# Altium schematic sheet Ethernet.SchDoc
size A3; SheetNumber: 6; SheetTotal: 8; DocumentSheetName: Ethernet
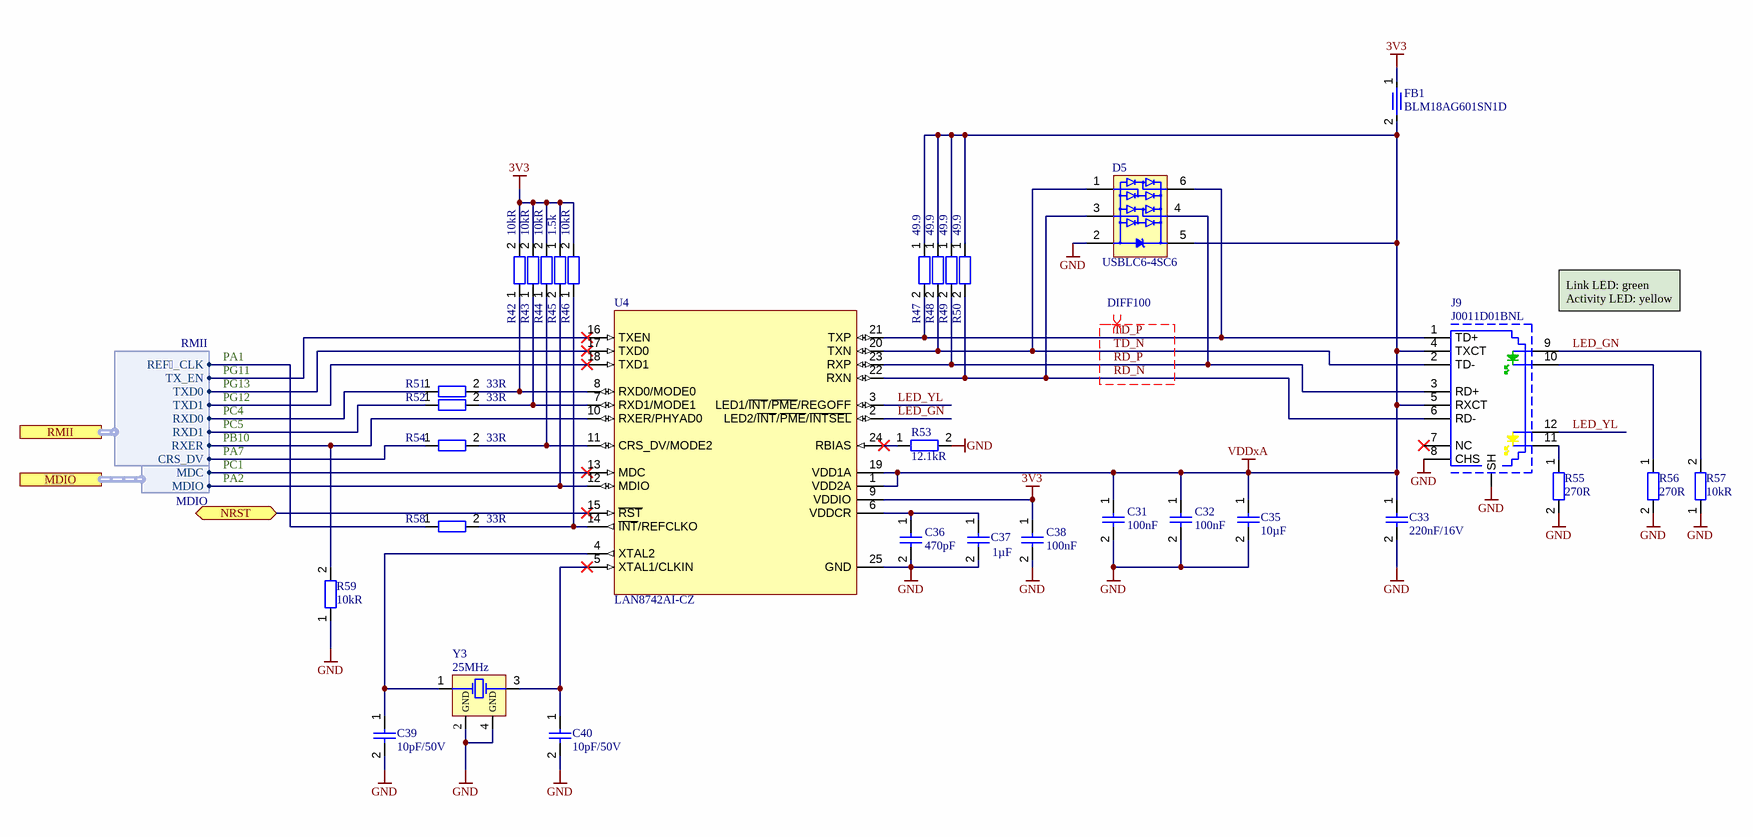
[diagram p0: Ethernet.SchDoc]

## Parts
C31  value 100nF  [CAPC1005X50N]  (hidden comment: 100nF/16V)
C32  value 100nF  [CAPC1005X50N]  (hidden comment: 100nF/16V)
C33  220nF/16V  [CAPC1005X50N]
C35  value 10µF  [CAPC1608X80N]  (hidden comment: 10uF/10V)
C36  value 470pF  [CAPC1005X50N]  (hidden comment: 470pF/50V)
C37  value 1µF  [CAPC1608X80N]  (hidden comment: 1uF/16V)
C38  value 100nF  [CAPC1608X80N]  (hidden comment: 100nF/50V)
C39  10pF/50V  [CAPC1005X50N]
C40  10pF/50V  [CAPC1005X50N]
D5  USBLC6-4SC6  [SOT95P280X120-6L]
FB1  BLM18AG601SN1D  [INDC1608X08L]
J9  J0011D01BNL  [PULSE_J0011D01BNL]
R42  10kR  [RESC1005X35N]
R43  10kR  [RESC1005X35N]
R44  10kR  [RESC1005X35N]
R45  value 1.5k  [RESC1005X35N]  (hidden comment: 1.5kR)
R46  10kR  [RESC1005X35N]
R47  value 49.9  [RESC1005X35N]  (hidden comment: 49.9R/0.1%)
R48  value 49.9  [RESC1005X35N]  (hidden comment: 49.9R/0.1%)
R49  value 49.9  [RESC1005X35N]  (hidden comment: 49.9R/0.1%)
R50  value 49.9  [RESC1005X35N]  (hidden comment: 49.9R/0.1%)
R51  33R  [RESC1005X35N]
R52  33R  [RESC1005X35N]
R53  12.1kR  [RESC1005X35N]
R54  33R  [RESC1005X35N]
R55  270R  [RESC1005X35N]
R56  270R  [RESC1005X35N]
R57  10kR  [RESC1005X35N]
R58  33R  [RESC1005X35N]
R59  10kR  [RESC1005X35N]
U4  LAN8742AI-CZ  [QFN50P400X400X90-25T260X260L]
Y3  Frequency: 25MHz  [OSCCC160X120X45-4]  (hidden comment: ABM12W-25.0000MHZ-8-B1U-T3)

## Ports
MDIO (harness MDIO), NRST (bidir), RMII (harness RMII)

## Harnesses
RMII: REF_CLK, TX_EN, TXD0, TXD1, RXD0, CRS_DV, RXD1, RXER
MDIO: MDC, MDIO

## Nets
3V3: C38.1 FB1.1 R42.2 R43.2 R44.2 R45.1 R46.2 U4.9(VDDIO)
GND: C31.2 C32.2 C33.2 C35.2 C36.2 C37.2 C38.2 C39.2 C40.2 D5.2(GND) J9.8(CHS) J9.SH R53.2 R55.2 R56.2 R57.1 R59.1 U4.25(GND) Y3.2(GND) Y3.4(GND)
VDDxA: C31.1 C32.1 C33.1 C35.1 D5.5(VBUS) FB1.2 J9.4(TXCT) J9.5(RXCT) R47.1 R48.1 R49.1 R50.1 U4.1(VDD2A) U4.19(VDD1A)
LED_GN: J9.9 R57.2 U4.2(LED2/~{INT}/~{PME}/~{INTSEL})
LED_YL: J9.12 U4.3(LED1/~{INT}/~{PME}/REGOFF)
NRST: U4.15(~{RST}) ; port NRST
RD_N: D5.3(I/O2) J9.6(RD-) R50.2 U4.22(RXN)
RD_P: D5.4(I/O3) J9.3(RD+) R49.2 U4.23(RXP)
TD_N: D5.1(I/O1) J9.2(TD-) R48.2 U4.20(TXN)
TD_P: D5.6(I/O4) J9.1(TD+) R47.2 U4.21(TXP)
NetC36_1: C36.1 C37.1 U4.6(VDDCR)
NetC39_1: C39.1 U4.4(XTAL2) Y3.1(X1)
NetC40_1: C40.1 U4.5(XTAL1/CLKIN) Y3.3(X2)
NetJ9_10: J9.10 R56.1
NetJ9_11: J9.11 R55.1
NetR42_1: R42.1 R51.2 U4.8(RXD0/MODE0)
NetR43_1: R43.1 R52.2 U4.7(RXD1/MODE1)
NetR44_1: R44.1 R54.2 U4.11(CRS_DV/MODE2)
NetR45_2: R45.2 U4.12(MDIO) ; port MDIO.MDIO
NetR46_1: R46.1 R58.2 U4.14(~{INT}/REFCLKO)
NetR51_1: R51.1 ; port RMII.RXD0
NetR52_1: R52.1 ; port RMII.RXD1
NetR53_1: R53.1 U4.24(RBIAS)
NetR54_1: R54.1 ; port RMII.CRS_DV
NetR58_1: R58.1 ; port RMII.REF_CLK
NetR59_2: R59.2 U4.10(RXER/PHYAD0) ; port RMII.RXER
NetU4_13: U4.13(MDC) ; port MDIO.MDC
NetU4_16: U4.16(TXEN) ; port RMII.TX_EN
NetU4_17: U4.17(TXD0) ; port RMII.TXD0
NetU4_18: U4.18(TXD1) ; port RMII.TXD1

Not connected (* = marked no-connect by the designer): J9 7(NC)*

## Layout directives
differential pair; differential pair class DIFF100: RD_N, RD_P, TD_N, TD_P

## Notes on the sheet
- (near J9) Link LED: green
  Activity LED: yellow
- PG13
- PG11
- PC4
- PA1
- PG12
- PC5
- PB10
- PA7
- PC1
- PA2
- Sheet Name
- Project Name
- Variant:
- Doc Number
- File:
- Repo:
- Revision:
- Date:
- Author:
- VC Rev:
- Sheet

## Library data of the parts
C31 C32 = CMP-001-00001-22: Cap MLCC, 100nF, 16V, X7R, 5%,  0402; Dielectricum: X7R; Type: MLCC; Case Code (Metric): 1005; Voltage Rating: 16V; Case/Package: 0402; Mounting Technology: SMD; Tolerance: 5%
C33 = CMP-00178-7: Cap MLCC, 220nF, 16V, X7R, 10%, 0402; Value: 220nF; Case/Package: 0402; Tolerance: 10%; Type: MLCC; Dielectricum: X7R; Case Code (Metric): 1005; Mounting Technology: SMD; Voltage Rating: 16V
C35 = CMP-001-00075-19: Cap MLCC, 10uF, 10V, X5R, 10%, 0603; Mounting Technology: SMD; Type: MLCC; Case Code (Metric): 1608; Voltage Rating: 10V; Tolerance: 10%; Dielectricum: X5R; Case/Package: 0603
C36 = CMP-00111-11: Cap MLCC, 470pF, 50V, COG, 1%, 0402; Dielectricum: C0G; Type: MLCC; Case/Package: 0402; Mounting Technology: SMD; Voltage Rating: 50V; Tolerance: 1%; Case Code (Metric): 1005
C37 = CMP-001-00004-21: Cap MLCC, 1uF, 16V, X7R, 10%, 0603; Type: MLCC; Mounting Technology: SMD; Case Code (Metric): 1608; Tolerance: 10%; Dielectricum: X7R; Case/Package: 0603; Voltage Rating: 16V
C38 = CMP-001-00017-21: Cap MLCC, 100nF, 50V, X7R, 10%, 0603; Voltage Rating: 50V; Dielectricum: X7R; Tolerance: 10%; Type: MLCC; Mounting Technology: SMD; Case Code (Metric): 1608; Case/Package: 0603
C39 C40 = CMP-001-00011-22: Cap MLCC, 10pF, 50V, C0G, 2.5%, 0402; Case/Package: 0402; Mounting Technology: SMD; Dielectricum: C0G; Voltage Rating: 50V; Case Code (Metric): 1005; Type: MLCC; Value: 10pF; Tolerance: 2.5%
D5 = CMP-00732-4: TVS Diode, unidirectional, 4 Signal + 2 Supply, 6Vbr, 5A, SOT23-6L, 4 data-line very low capacitance ESD protection; Rated Voltage: 6V; Peak Current: 5A; Direction: unidirectional; Mounting Technology: SMD; Size: L2.9B1.6H1.2; Case/Package: SOT-23-6L; Connection: 4 Signal + 2 Supply
FB1 = CMP-006-00088-4: Ferrite Bead, 0.38R @ DC, 600R @ 100MHz, 25%, 0603; Current: 500mA; Impedance DC: 0.38; Case/Package: 0603; Mounting Technology: SMD; Impedance: 600R @ 100MHz; Tolerance: 25%; Case Code (Metric): 1608
J9 = CMP-00777-4: RJ45, 12 Pin, Female, Horizontal, THT, L22B16H14, with Magnetics, Shielded, 2 LED gn/ye; Manufacturer: Pulse; Connection: Pluggable; Pin Mapping: 2x4; Mounting Technology: THT; Angle: Horizontal; Size: L22B16H14; Gender: Female; Type: RJ45; Pins: 12
R42-R44 R46 R57 R59 = CMP-009-00298-12: Res, 10kR, 1%, 0.063W, 0402; Value: 10k; Power: 63mW; Voltage Rating: 50V; Tolerance: 1%; Type: Fixed; Case Code (Metric): 1005; Case/Package: 0402; Mounting Technology: SMD
R45 = CMP-009-00284-14: Res, 1.5kR, 1%, 0.063W, 0402; Power: 63mW; Voltage Rating: 50V; Tolerance: 1%; Case/Package: 0402; Type: Fixed; Case Code (Metric): 1005; Mounting Technology: SMD
R47-R50 = CMP-009-00337-8: Res, 49.9R, 0.1%, 0.063W, 0402; Voltage Rating: 50V; Power: 63mW; Tolerance: 0.1%; Mounting Technology: SMD; Case/Package: 0402; Case Code (Metric): 1005; Type: Fixed
R51 R52 R54 R58 = CMP-009-00029-35: Res, 33R, 1%, 0.063W, 0402; Power: 63mW; Value: 33; Voltage Rating: 50V; Case/Package: 0402; Case Code (Metric): 1005; Type: Fixed; Tolerance: 1%; Mounting Technology: SMD
R53 = CMP-009-00371-6: Res, 12.1kR, 1%, 0.063W, 0402; Voltage Rating: 50V; Value: 12.1k; Power: 63mW; Type: Fixed; Case/Package: 0402; Mounting Technology: SMD; Tolerance: 1%; Case Code (Metric): 1005
R55 R56 = CMP-009-00408-6: Res, 270R, 1%, 0.063W, 0402; Power: 63mW; Voltage Rating: 50V; Value: 270; Tolerance: 1%; Type: Fixed; Case Code (Metric): 1005; Mounting Technology: SMD; Case/Package: 0402
U4 = CMP-00241-15: Bus Interface, Ethernet PHY, 1.62.. 3.6V, VQFN-24, L4B4H1; Min Supply Voltage: 1.62V; Channels: 1; Bus Type: Ethernet PHY; Case/Package: VQFN; Size: L4B4H1; Mounting Technology: SMD; Max Supply Voltage: 3.6V
Y3 = CMP-00838-4: Crystal Quartz, 25MHz, ±10ppm, 8pF, SMD-4, L1.6B1.2H0.4; ESR: 80; Type: Quartz; Size: L1.6B1.2H0.4; Tolerance: 10ppm; Load Capacitance: 8pF; Case/Package: SMD-4; Mounting Technology: SMD